# EAGLE schematic display-board (EAGLE 7.7.0)
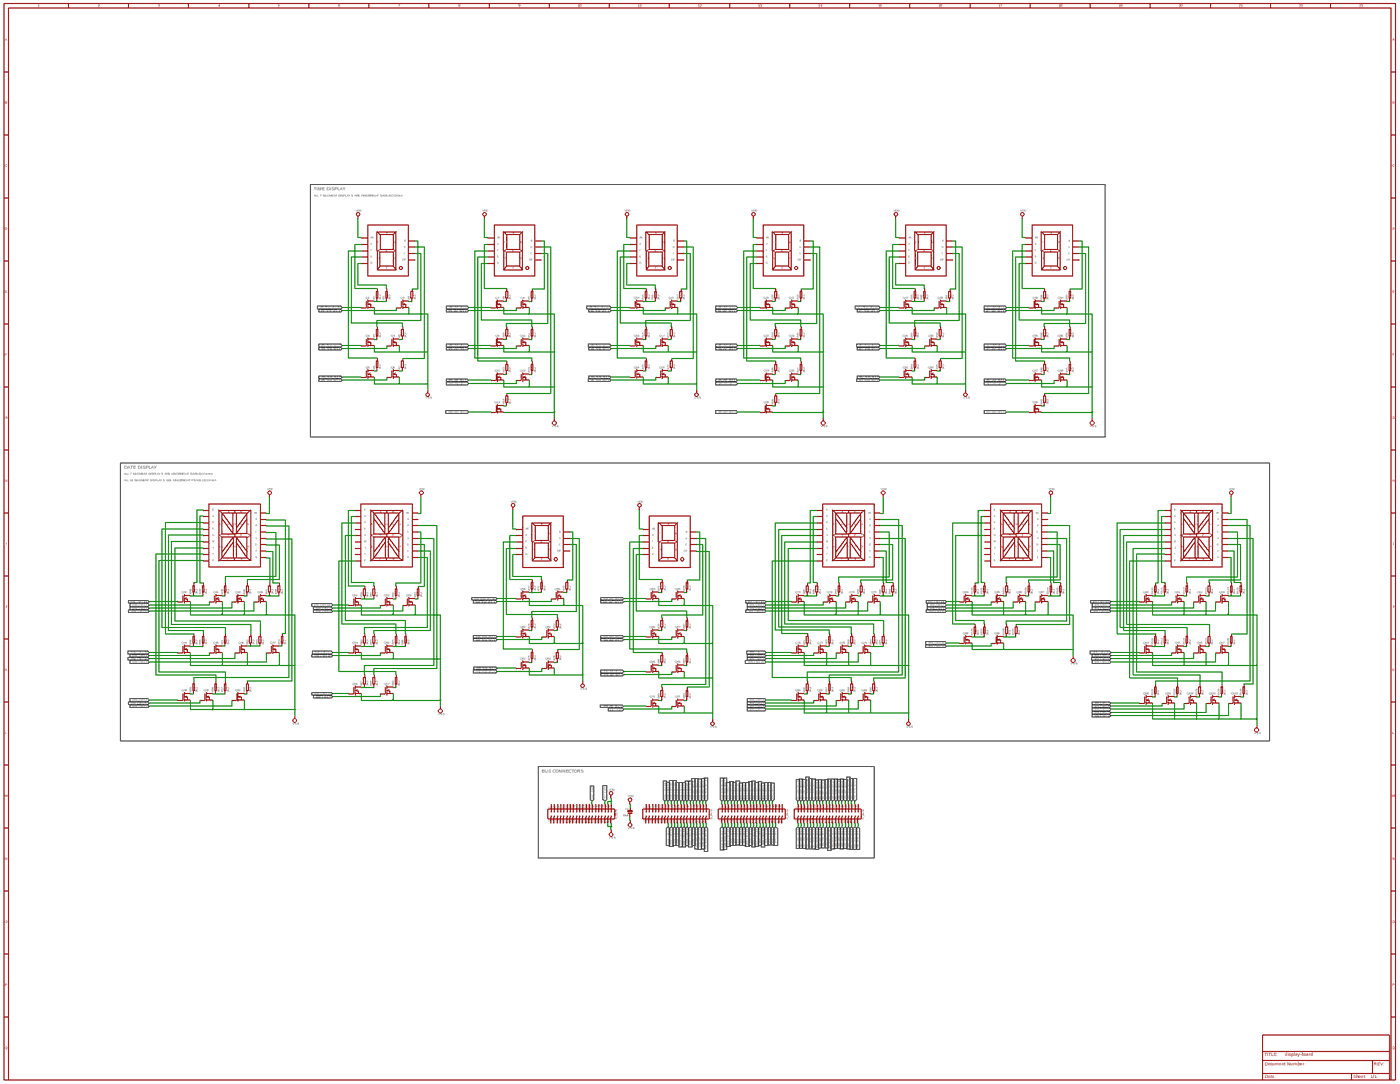
[diagram p0: schematic, sheet 1, overview]
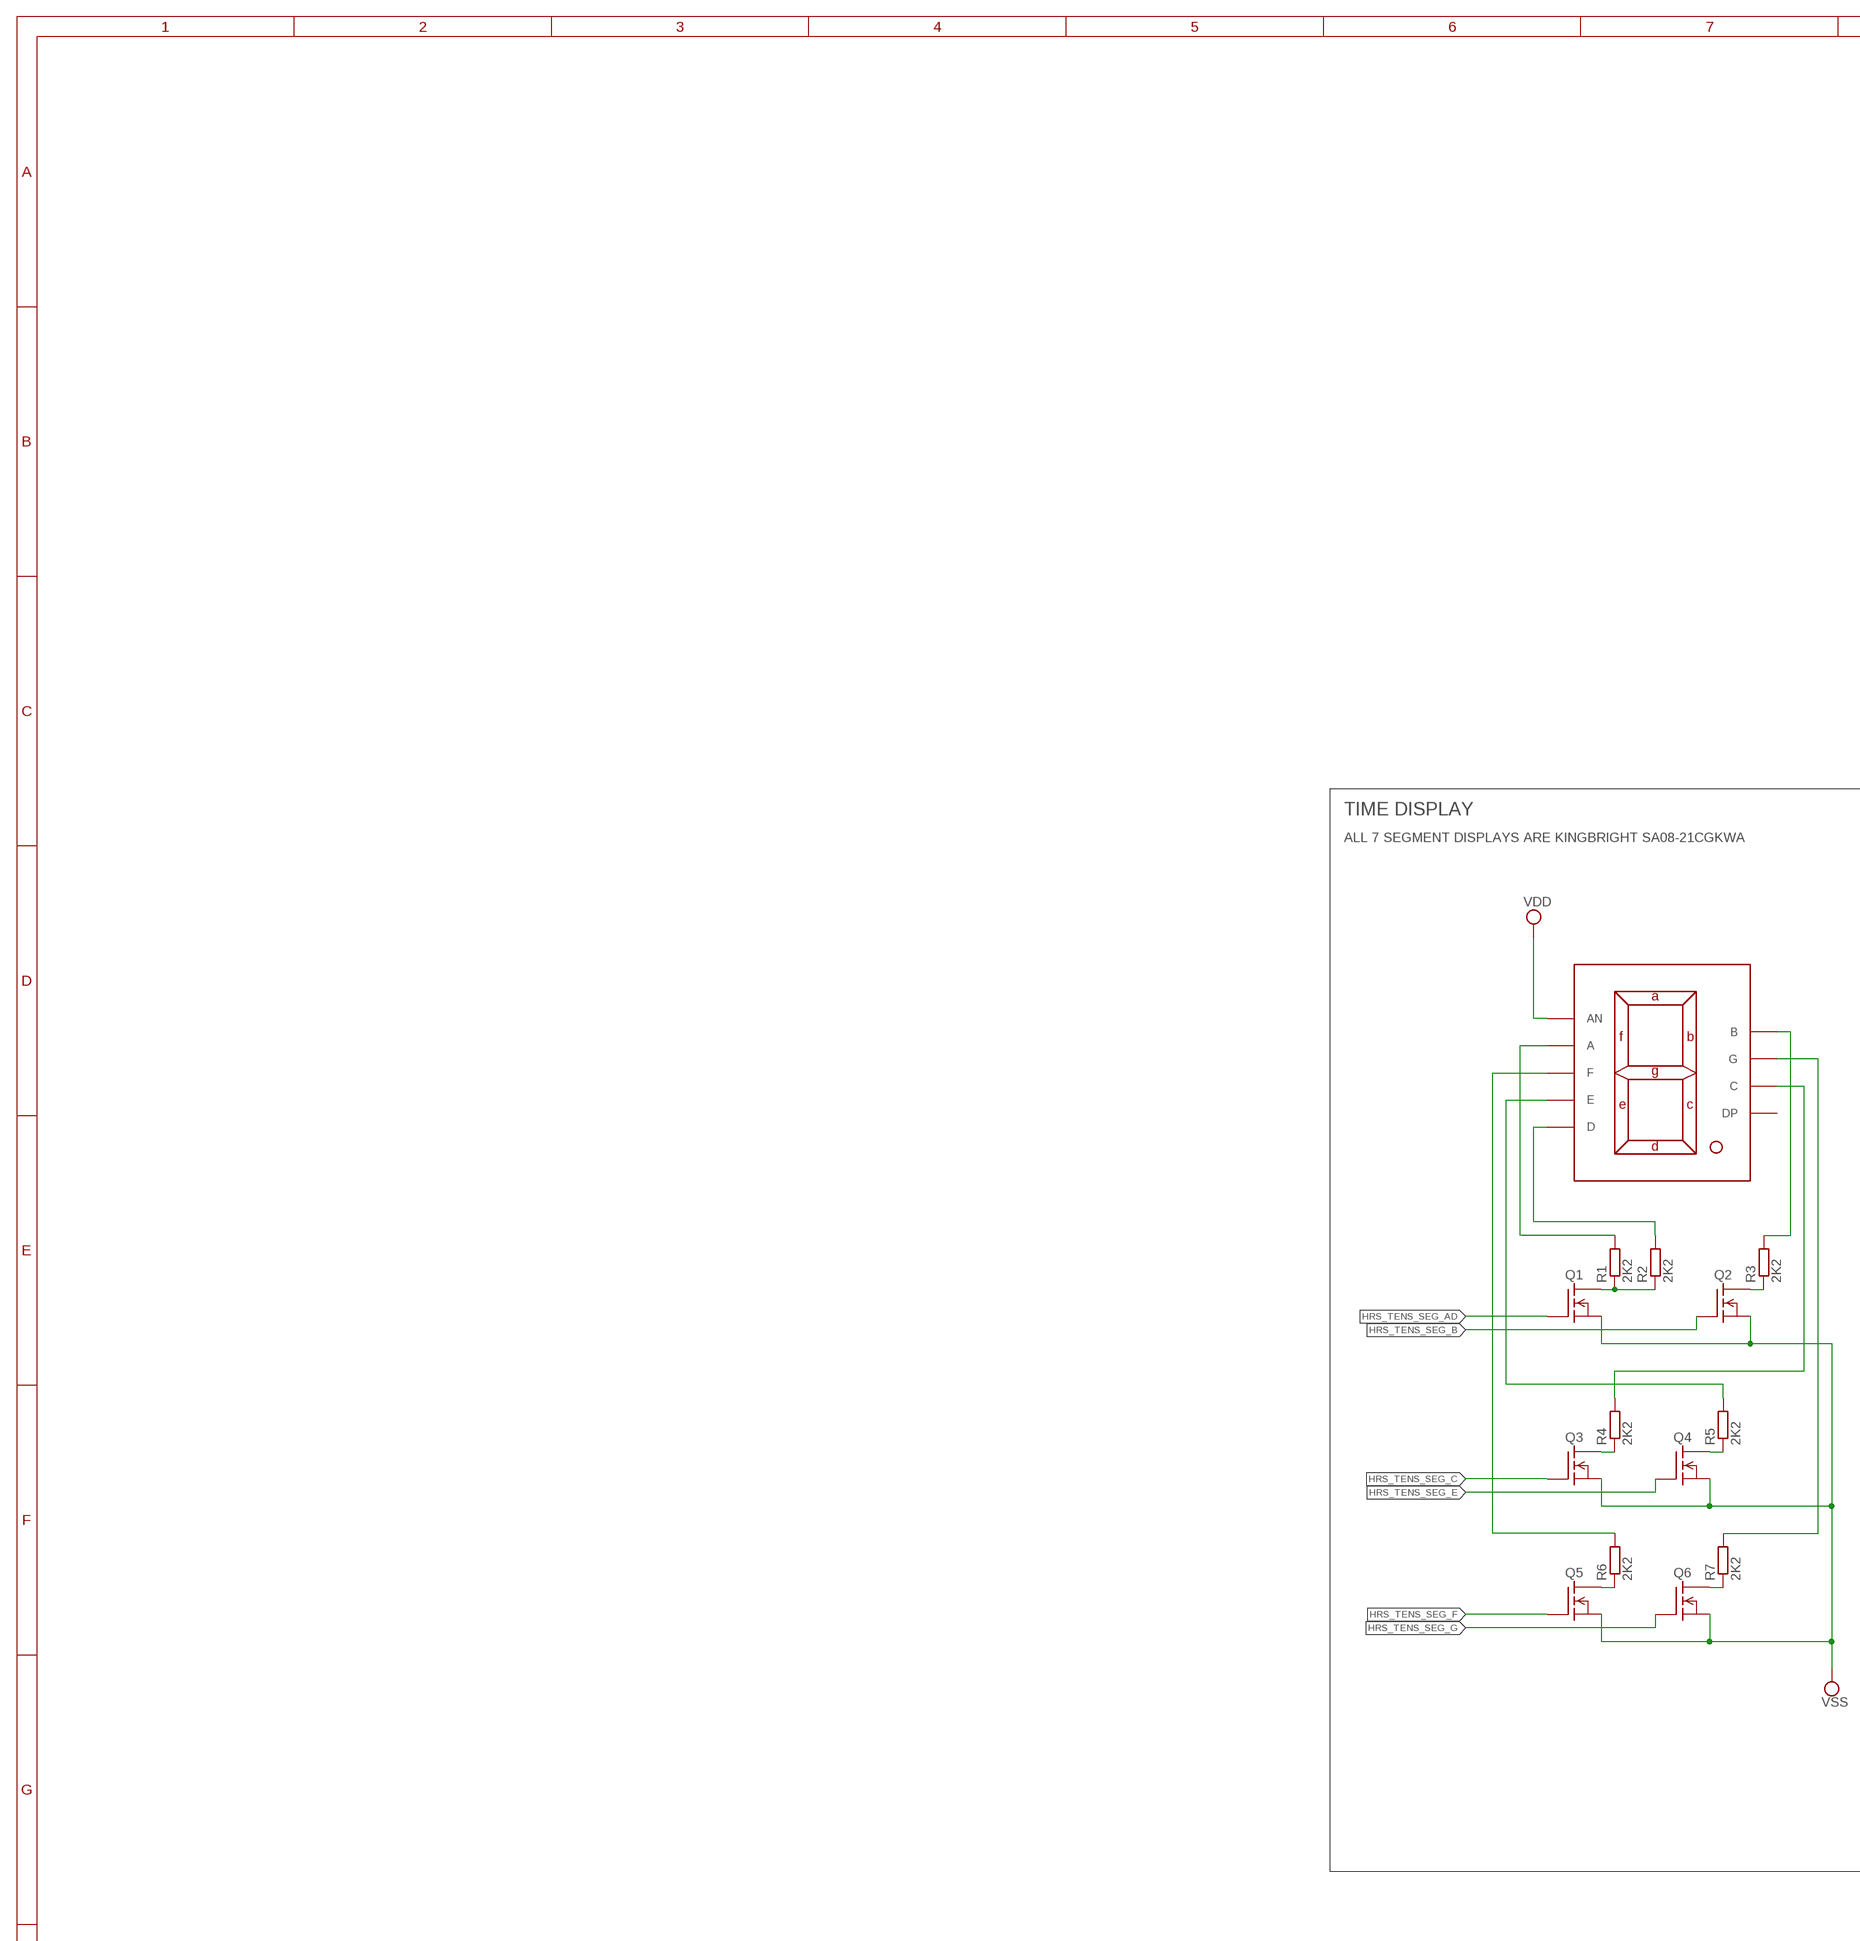
[diagram p1: schematic, sheet 1, part 1 of 6]
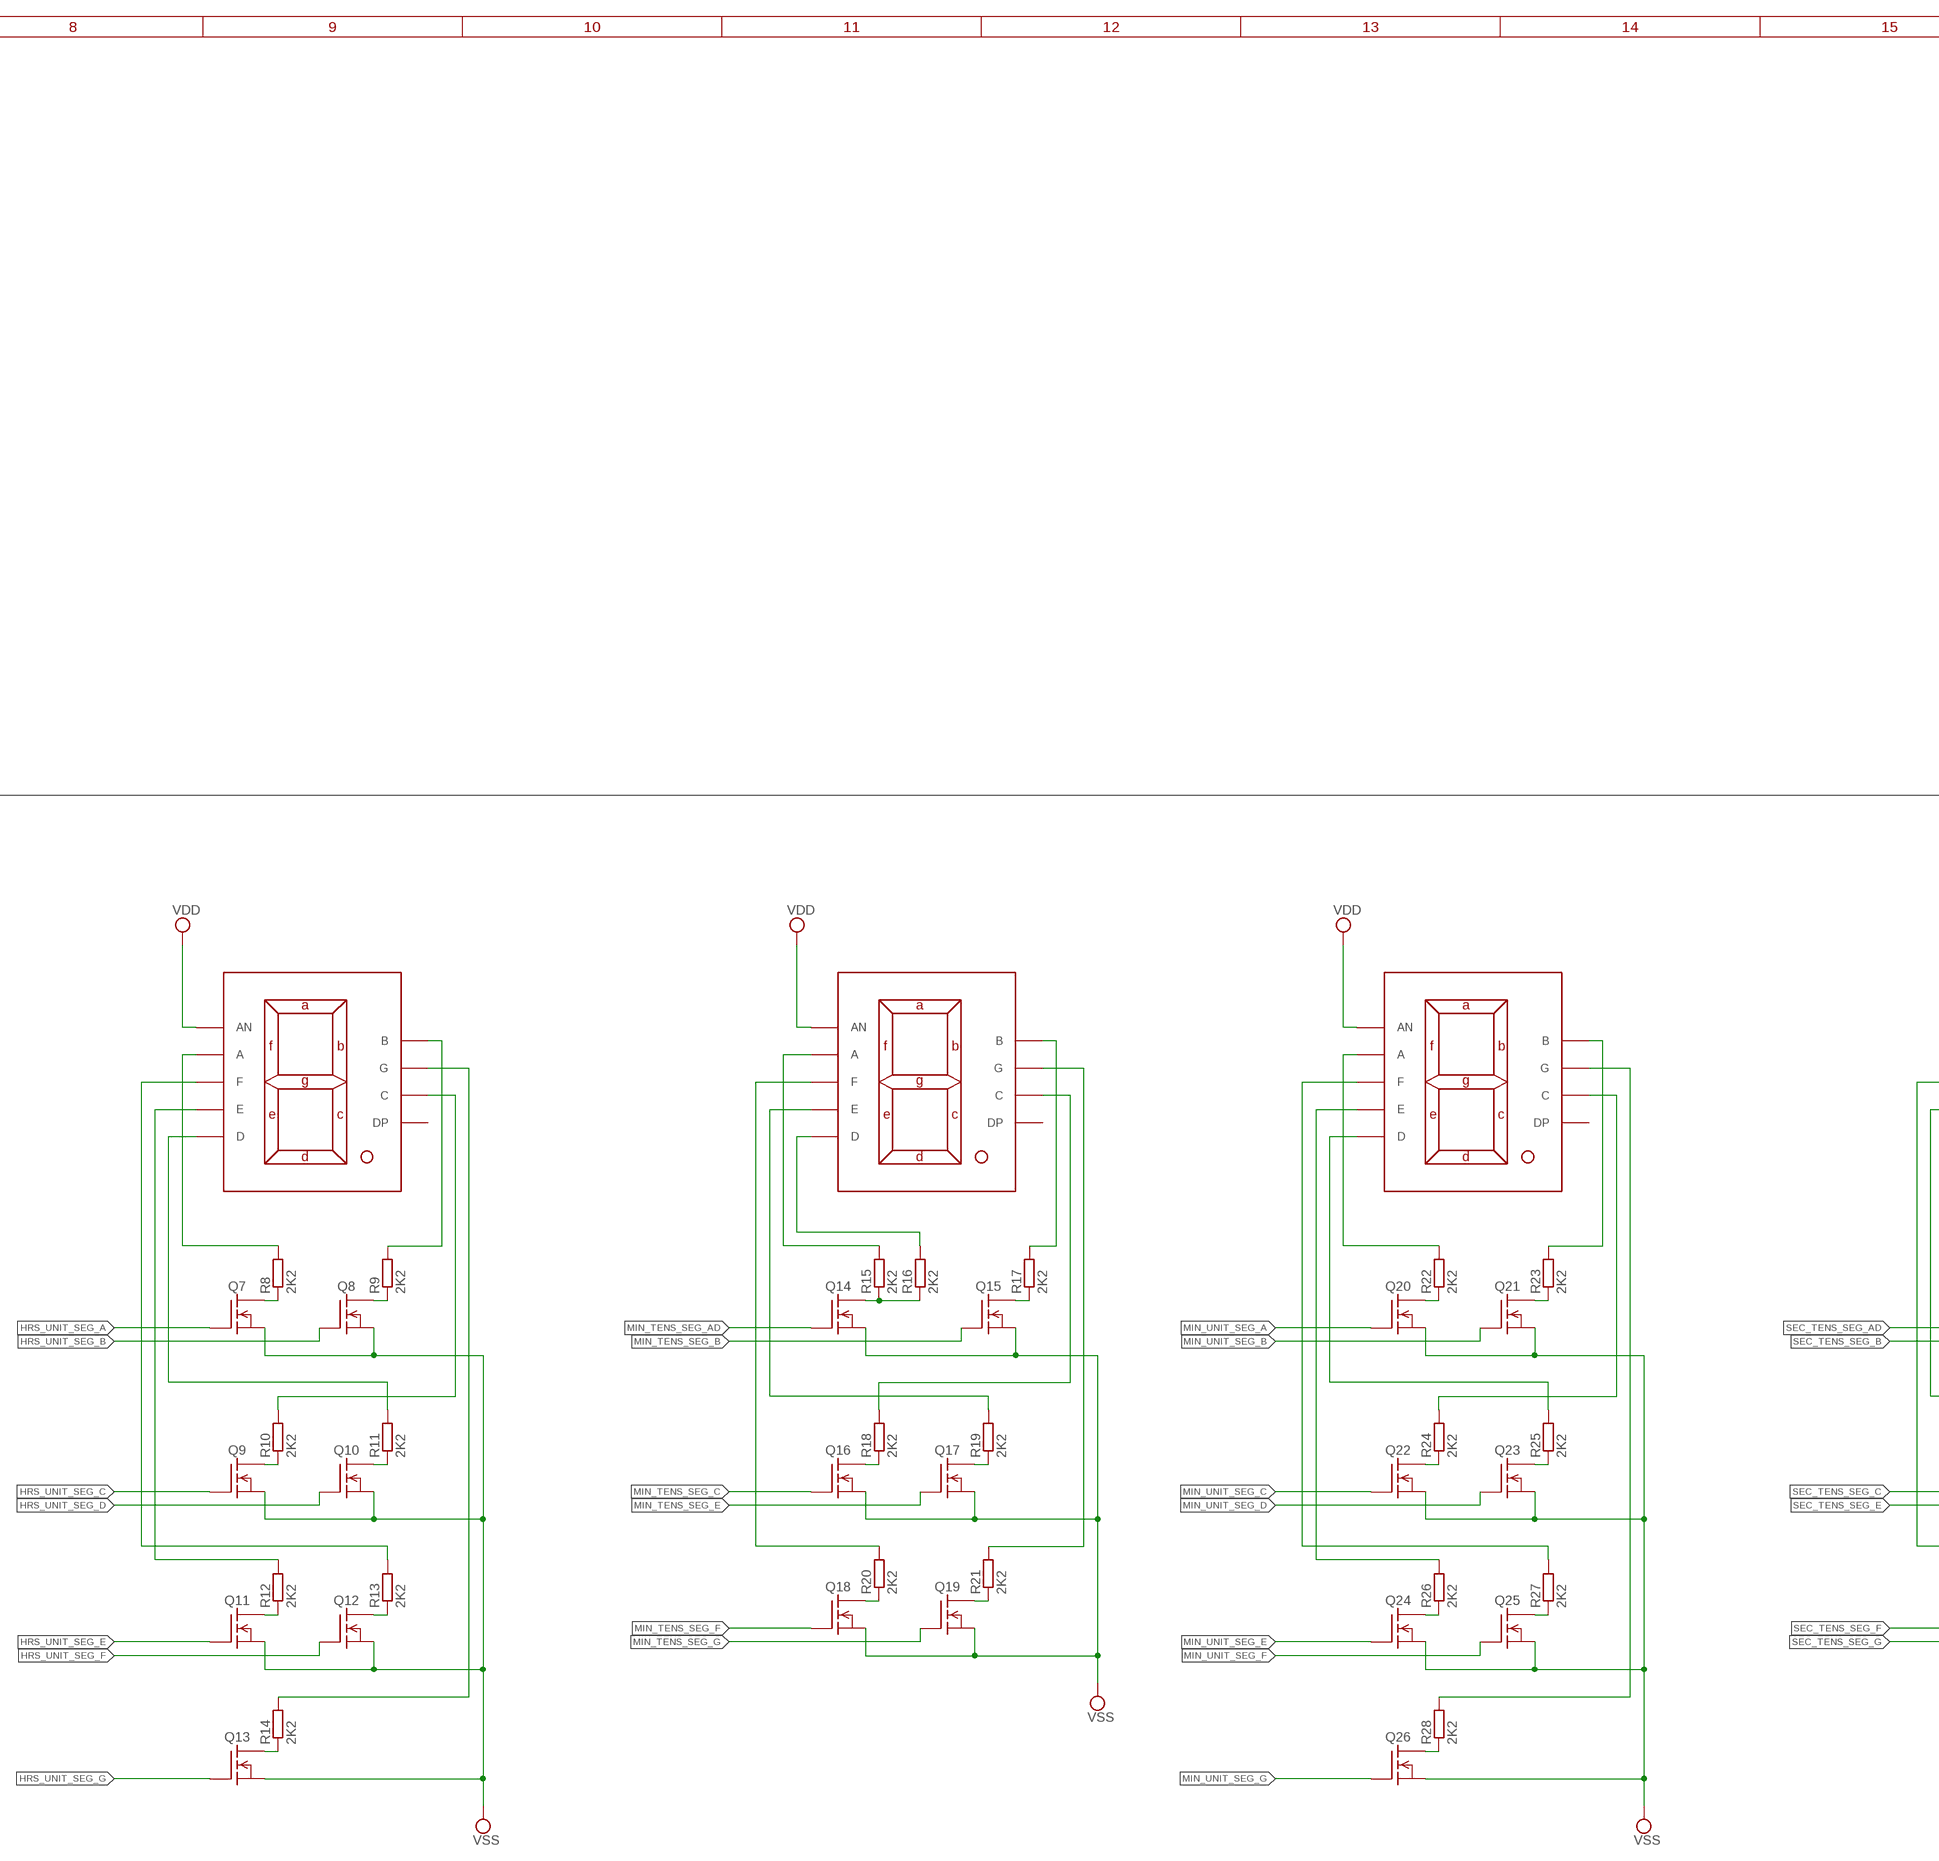
[diagram p2: schematic, sheet 1, part 2 of 6]
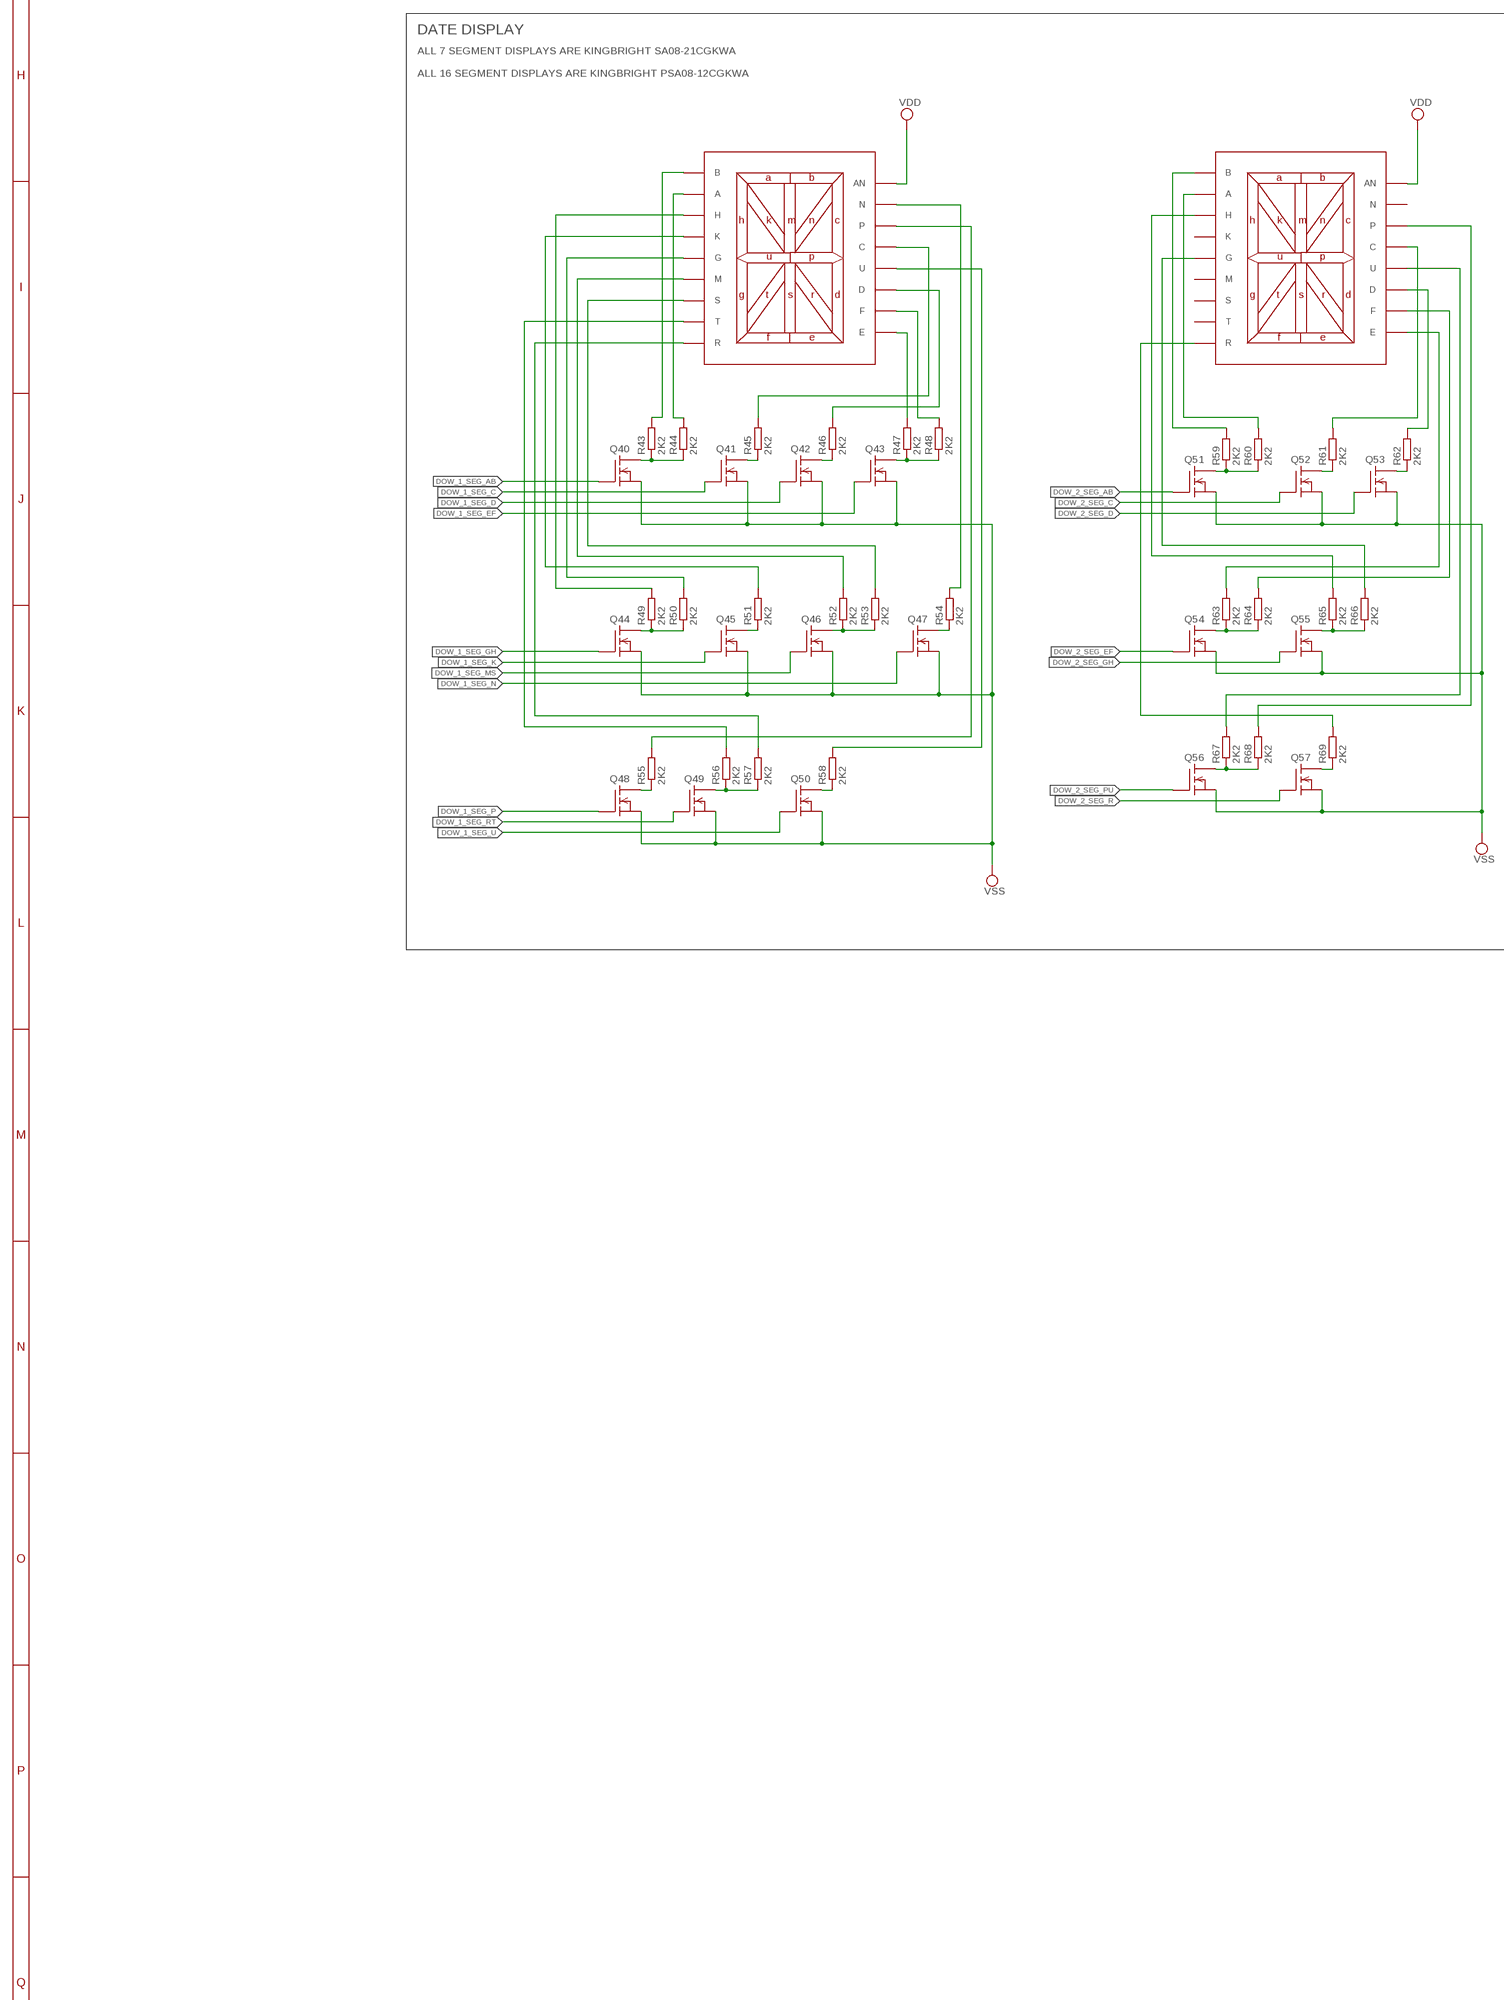
[diagram p3: schematic, sheet 1, part 3 of 6]
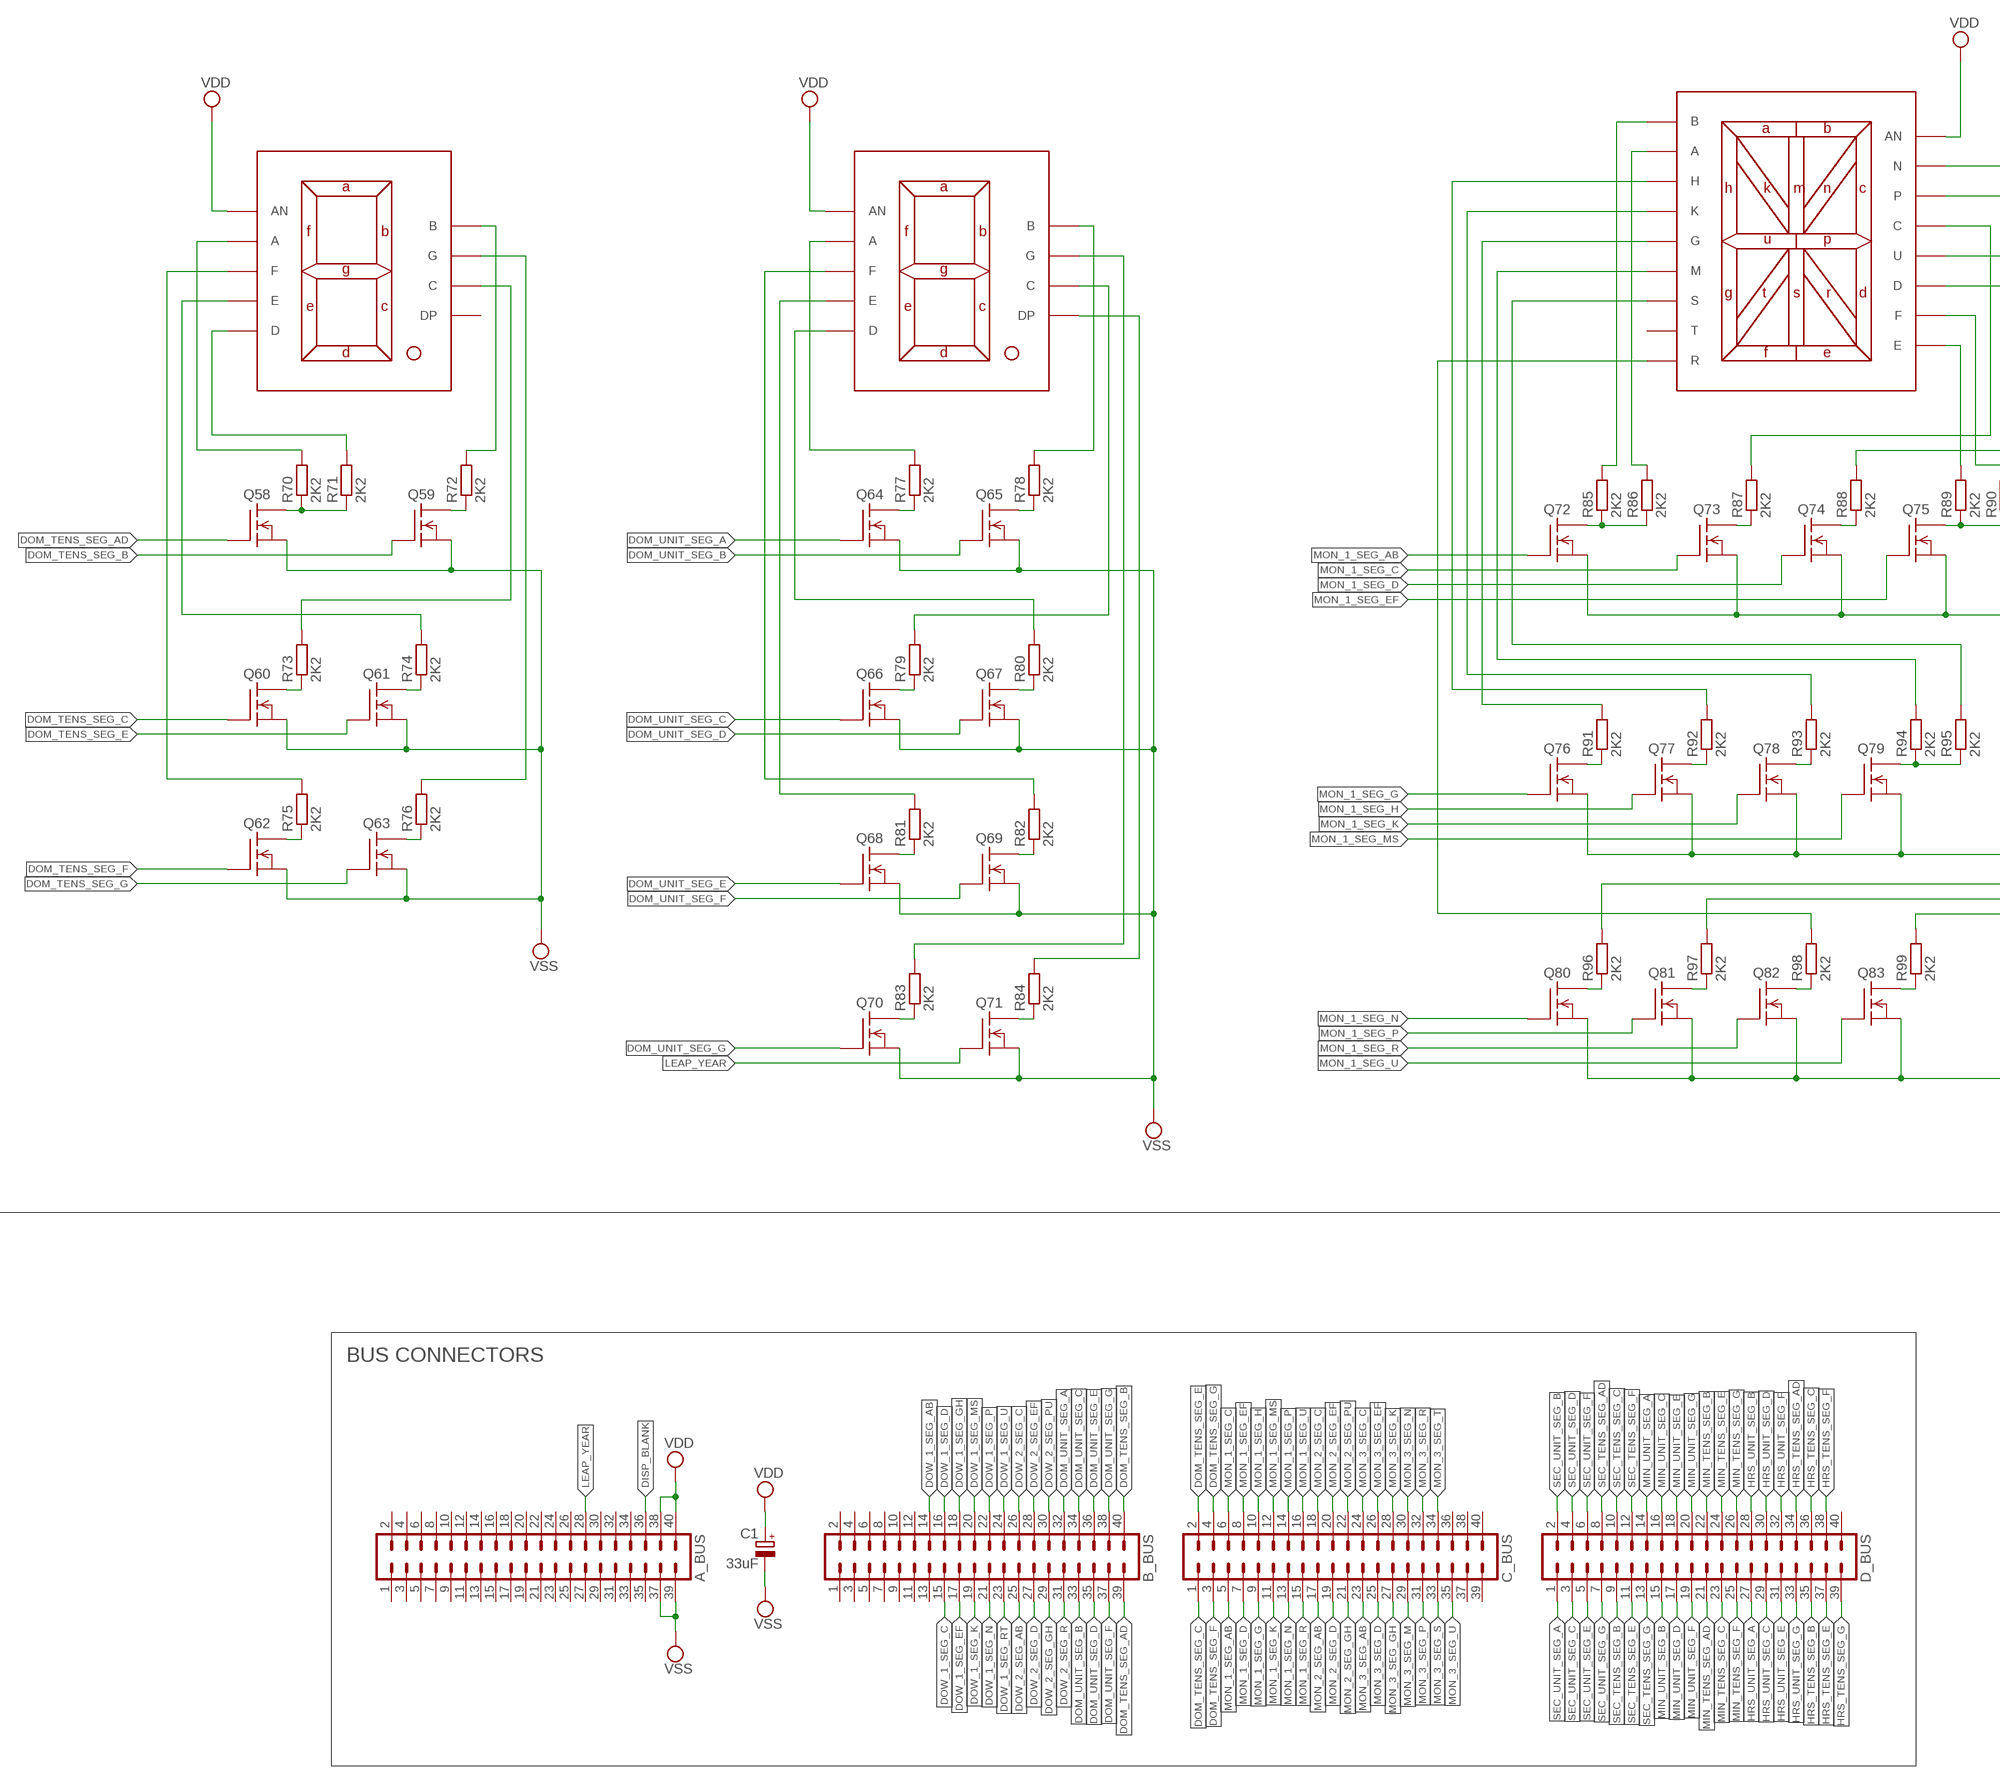
[diagram p4: schematic, sheet 1, part 4 of 6]
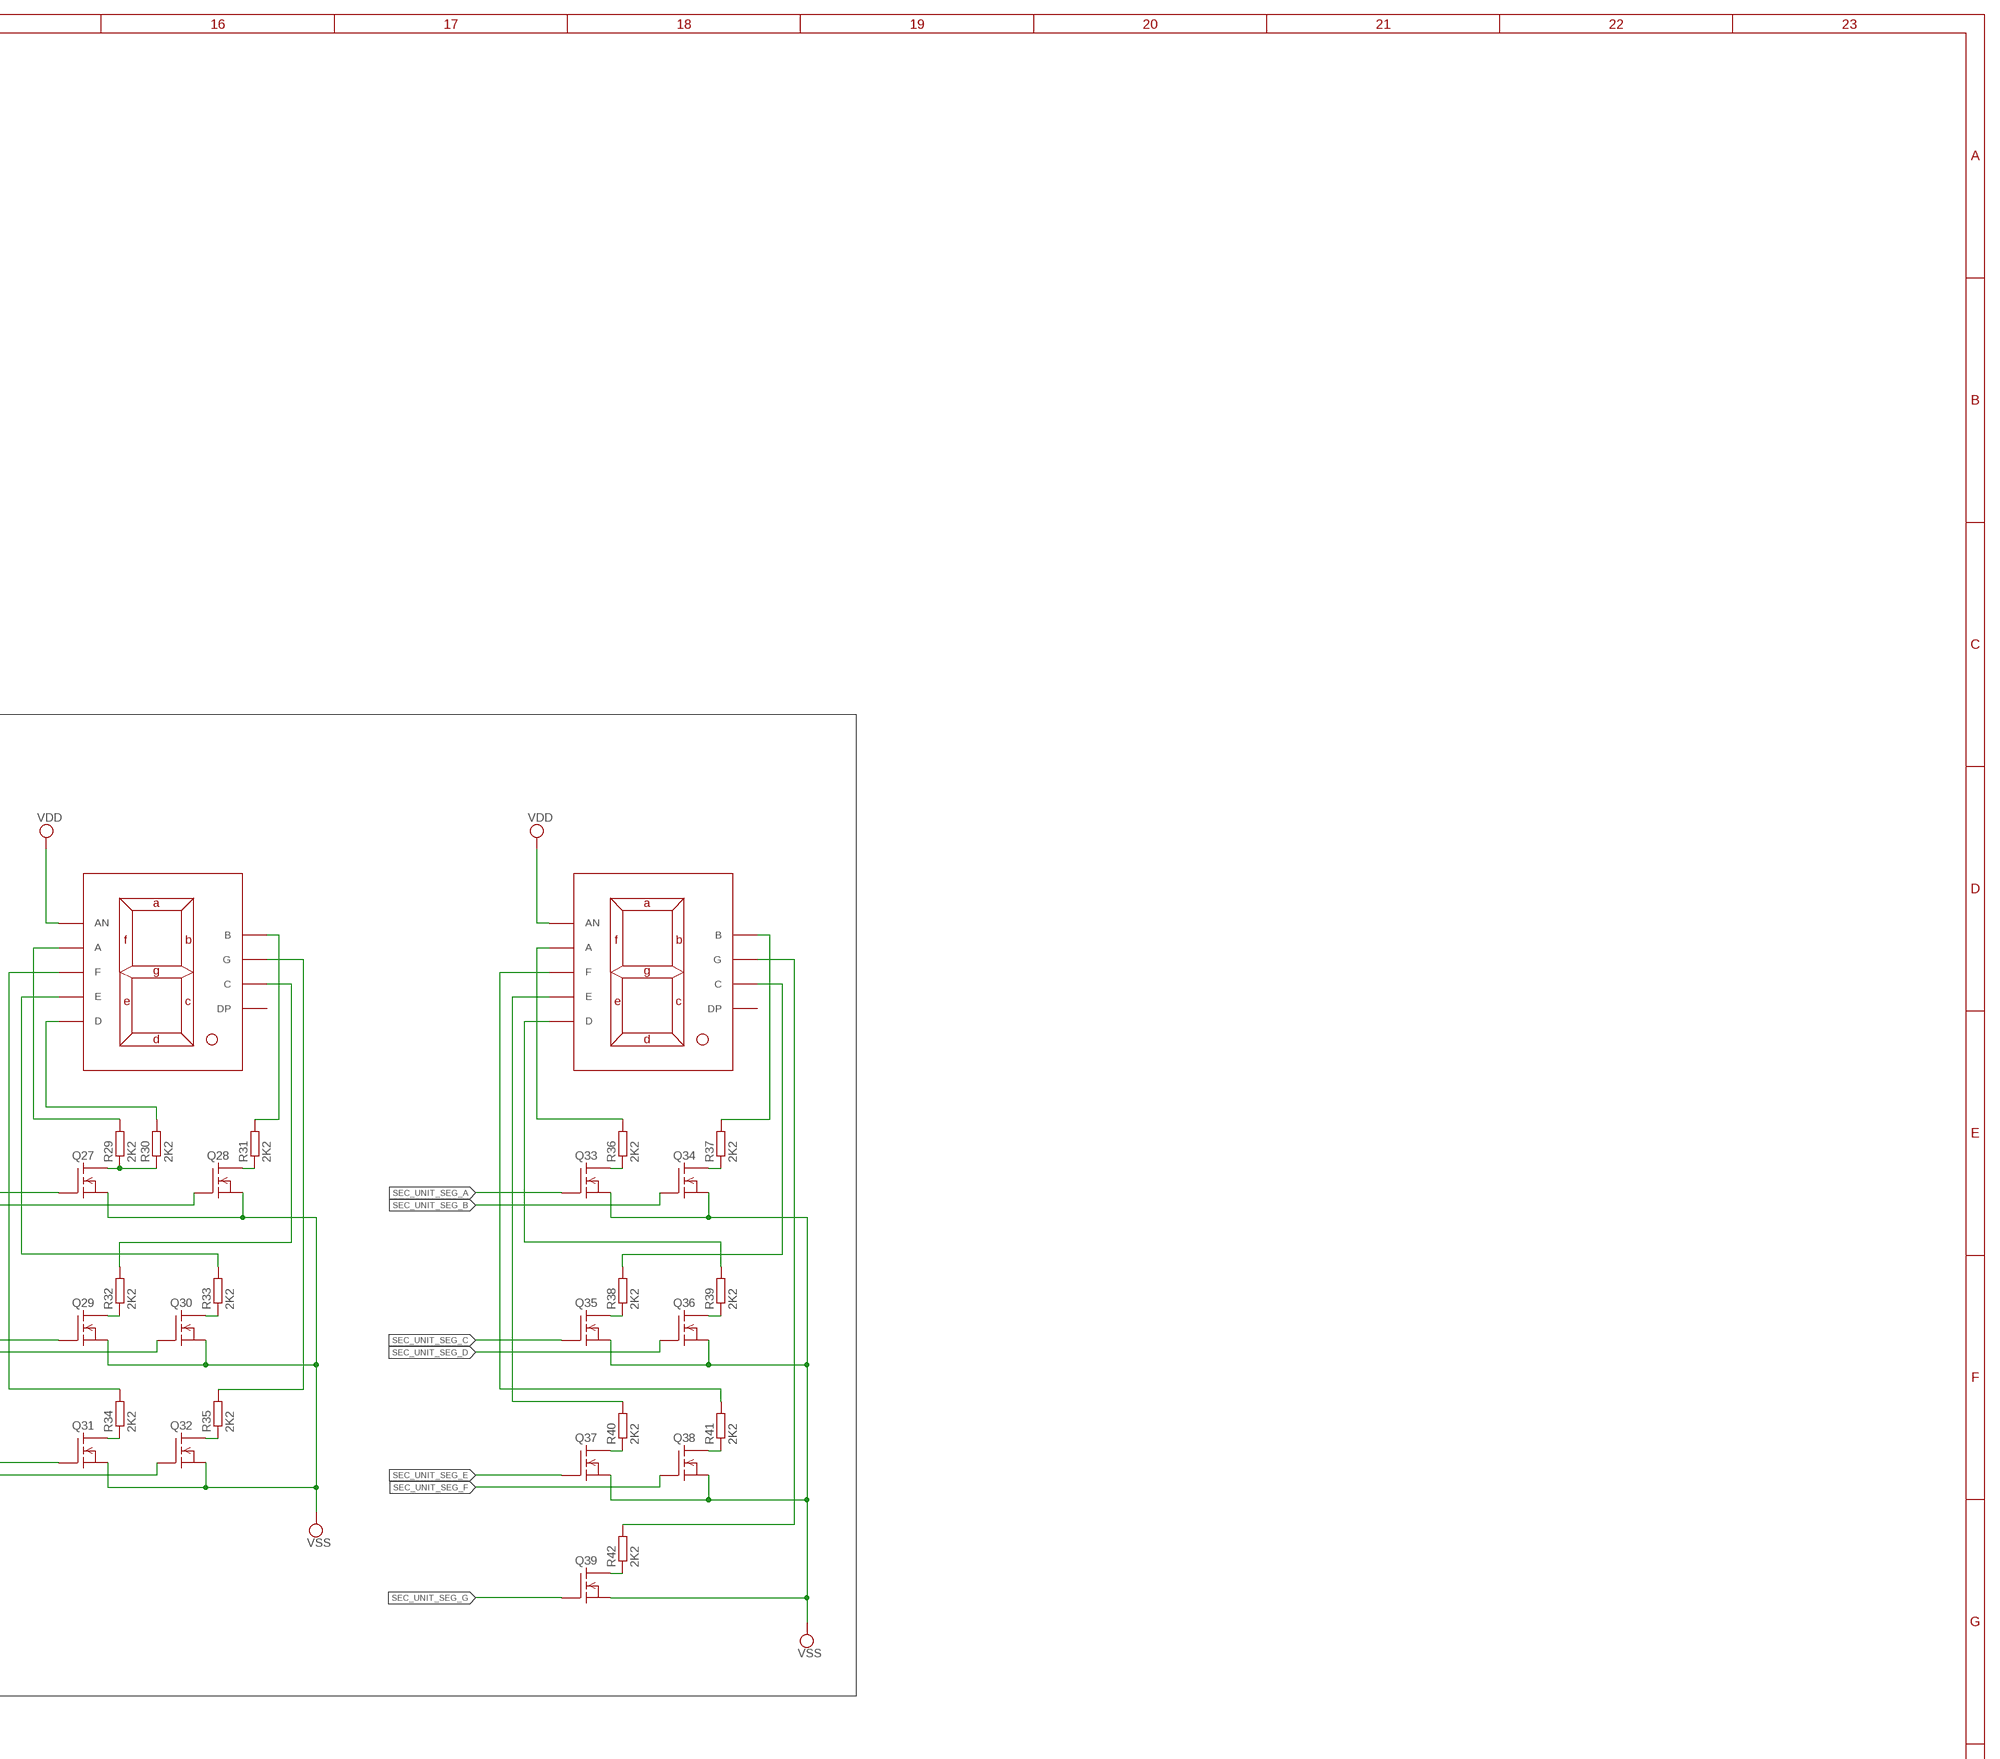
[diagram p5: schematic, sheet 1, part 5 of 6]
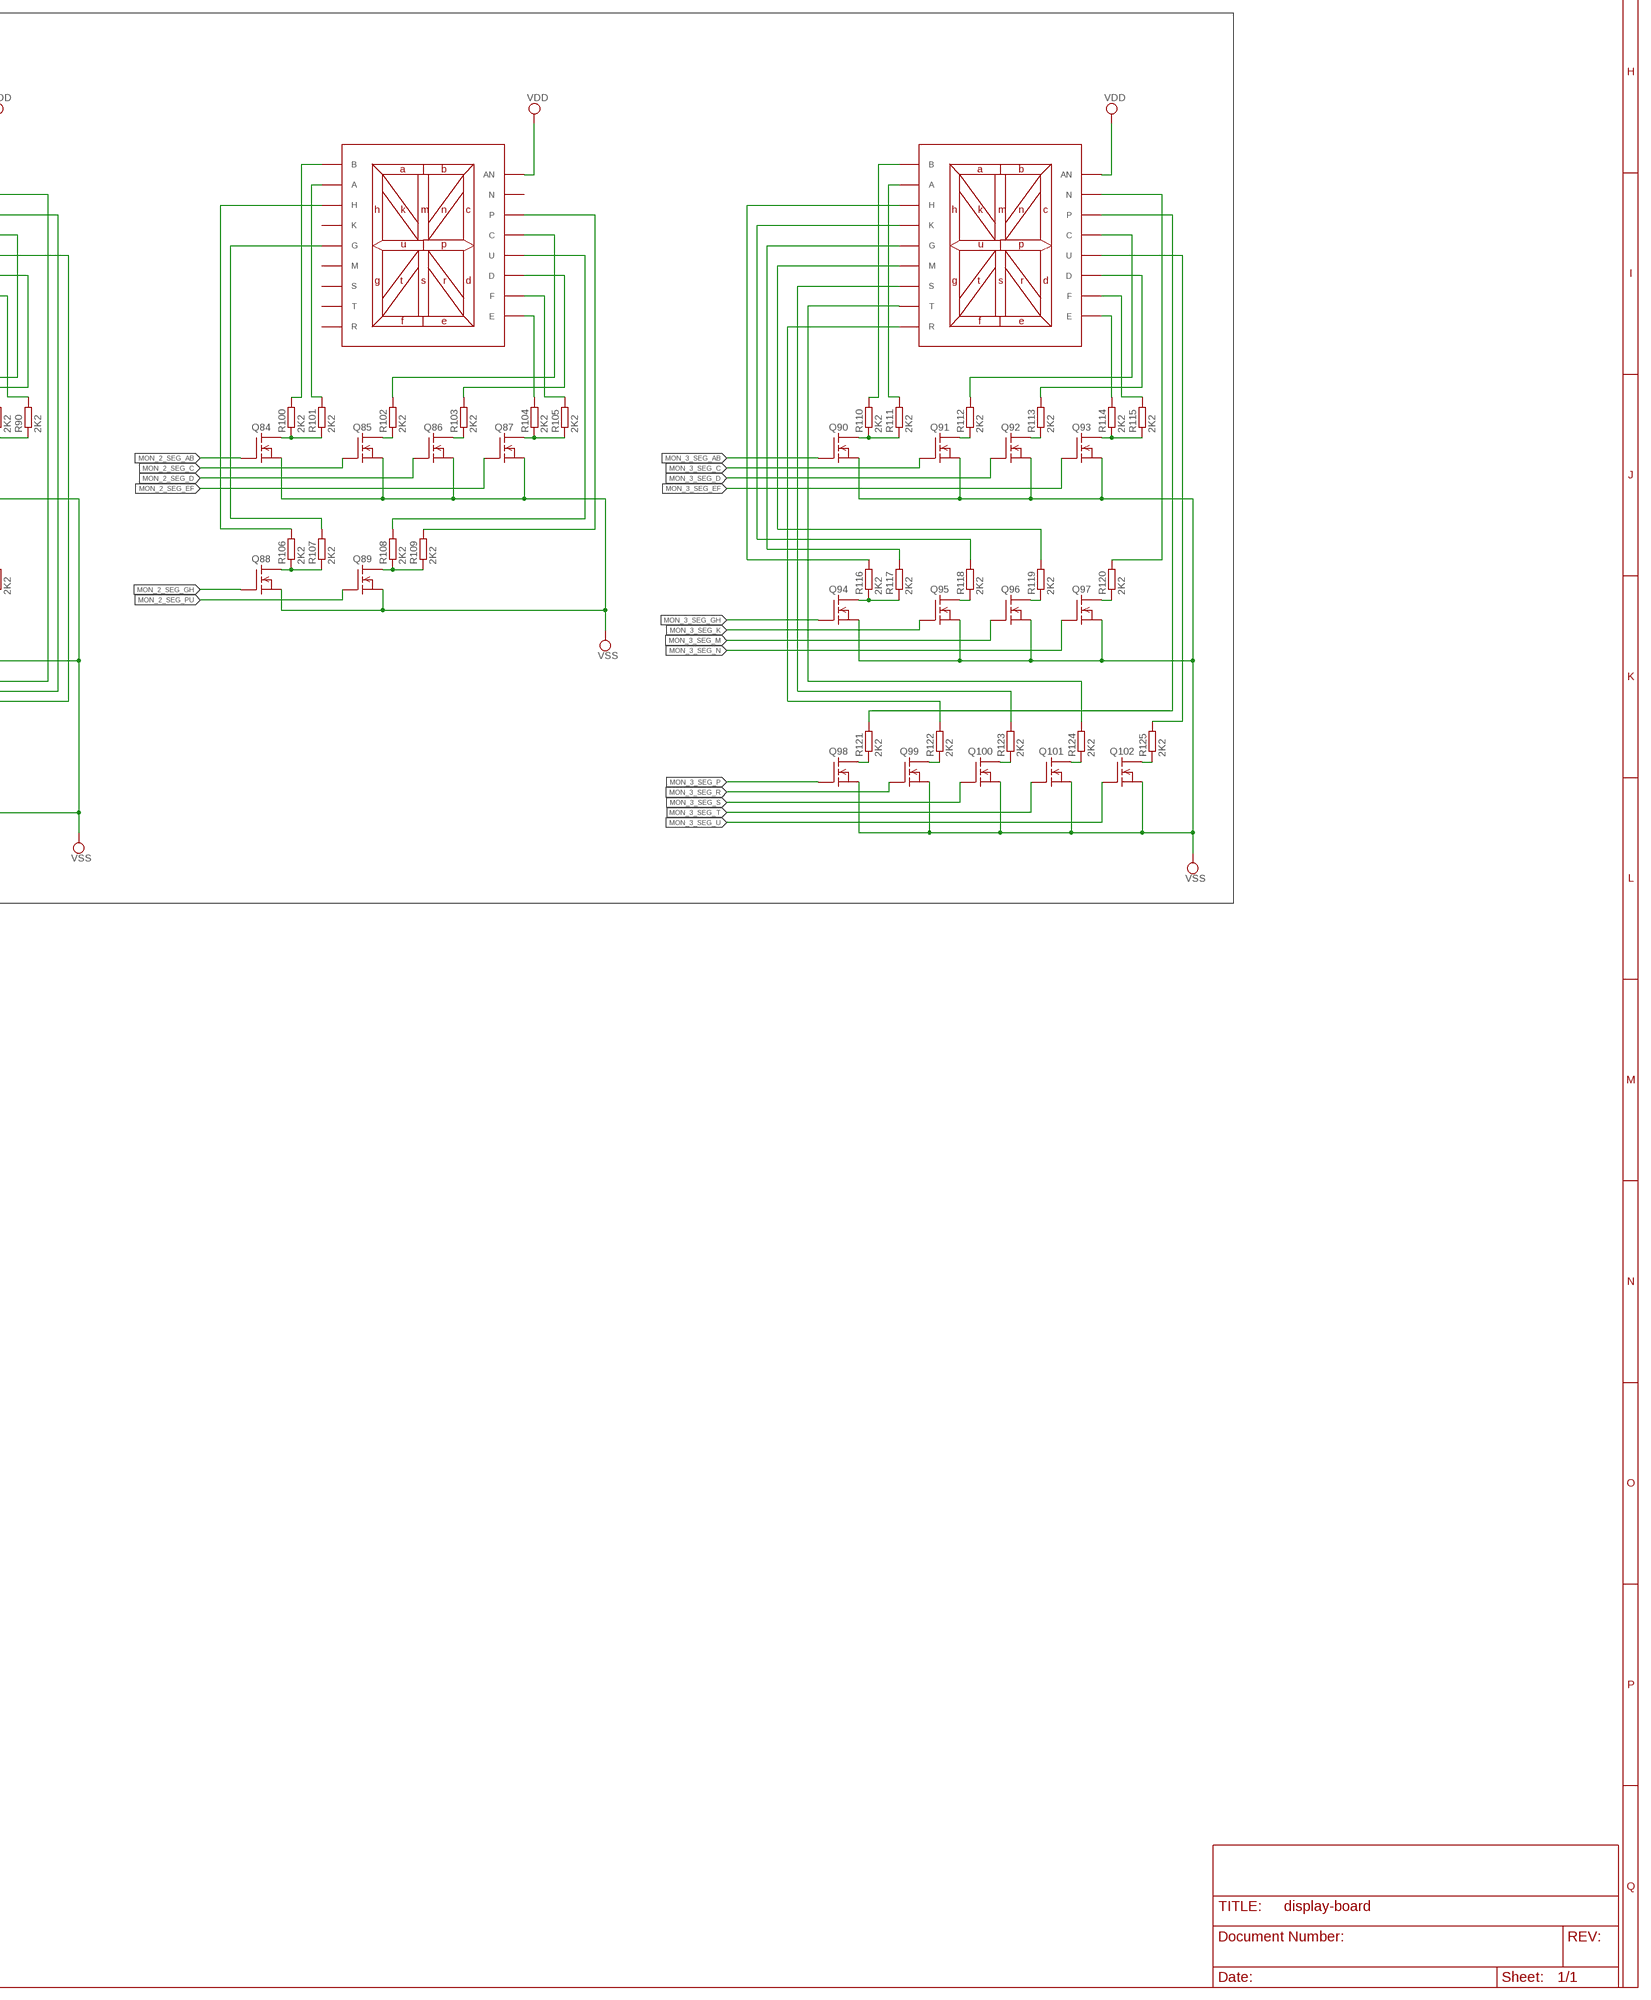
[diagram p6: schematic, sheet 1, part 6 of 6]

## Parts
A_BUS  MA20-2  [MA20-2]
B_BUS  MA20-2  [MA20-2]
C1  33uF  CPOL-EUE2.5-6  [E2,5-6]
C_BUS  MA20-2  [MA20-2]
D_BUS  MA20-2  [MA20-2]
LED1  SA08-21CGKWA  [SA08-21CGKWA]
LED2  SA08-21CGKWA  [SA08-21CGKWA]
LED3  SA08-21CGKWA  [SA08-21CGKWA]
LED4  SA08-21CGKWA  [SA08-21CGKWA]
LED5  SA08-21CGKWA  [SA08-21CGKWA]
LED6  SA08-21CGKWA  [SA08-21CGKWA]
LED7  PSA08-12CGKWA  [PSA08-12CGKWA]
LED8  PSA08-12CGKWA  [PSA08-12CGKWA]
LED9  SA08-21CGKWA  [SA08-21CGKWA]
LED10  SA08-21CGKWA  [SA08-21CGKWA]
LED11  PSA08-12CGKWA  [PSA08-12CGKWA]
LED12  PSA08-12CGKWA  [PSA08-12CGKWA]
LED13  PSA08-12CGKWA  [PSA08-12CGKWA]
Q1  2N7000  [TO-92]
Q2  2N7000  [TO-92]
Q3  2N7000  [TO-92]
Q4  2N7000  [TO-92]
Q5  2N7000  [TO-92]
Q6  2N7000  [TO-92]
Q7  2N7000  [TO-92]
Q8  2N7000  [TO-92]
Q9  2N7000  [TO-92]
Q10  2N7000  [TO-92]
Q11  2N7000  [TO-92]
Q12  2N7000  [TO-92]
Q13  2N7000  [TO-92]
Q14  2N7000  [TO-92]
Q15  2N7000  [TO-92]
Q16  2N7000  [TO-92]
Q17  2N7000  [TO-92]
Q18  2N7000  [TO-92]
Q19  2N7000  [TO-92]
Q20  2N7000  [TO-92]
Q21  2N7000  [TO-92]
Q22  2N7000  [TO-92]
Q23  2N7000  [TO-92]
Q24  2N7000  [TO-92]
Q25  2N7000  [TO-92]
Q26  2N7000  [TO-92]
Q27  2N7000  [TO-92]
Q28  2N7000  [TO-92]
Q29  2N7000  [TO-92]
Q30  2N7000  [TO-92]
Q31  2N7000  [TO-92]
Q32  2N7000  [TO-92]
Q33  2N7000  [TO-92]
Q34  2N7000  [TO-92]
Q35  2N7000  [TO-92]
Q36  2N7000  [TO-92]
Q37  2N7000  [TO-92]
Q38  2N7000  [TO-92]
Q39  2N7000  [TO-92]
Q40  2N7000  [TO-92]
Q41  2N7000  [TO-92]
Q42  2N7000  [TO-92]
Q43  2N7000  [TO-92]
Q44  2N7000  [TO-92]
Q45  2N7000  [TO-92]
Q46  2N7000  [TO-92]
Q47  2N7000  [TO-92]
Q48  2N7000  [TO-92]
Q49  2N7000  [TO-92]
Q50  2N7000  [TO-92]
Q51  2N7000  [TO-92]
Q52  2N7000  [TO-92]
Q53  2N7000  [TO-92]
Q54  2N7000  [TO-92]
Q55  2N7000  [TO-92]
Q56  2N7000  [TO-92]
Q57  2N7000  [TO-92]
Q58  2N7000  [TO-92]
Q59  2N7000  [TO-92]
Q60  2N7000  [TO-92]
Q61  2N7000  [TO-92]
Q62  2N7000  [TO-92]
Q63  2N7000  [TO-92]
Q64  2N7000  [TO-92]
Q65  2N7000  [TO-92]
Q66  2N7000  [TO-92]
Q67  2N7000  [TO-92]
Q68  2N7000  [TO-92]
Q69  2N7000  [TO-92]
Q70  2N7000  [TO-92]
Q71  2N7000  [TO-92]
Q72  2N7000  [TO-92]
Q73  2N7000  [TO-92]
Q74  2N7000  [TO-92]
Q75  2N7000  [TO-92]
Q76  2N7000  [TO-92]
Q77  2N7000  [TO-92]
Q78  2N7000  [TO-92]
Q79  2N7000  [TO-92]
Q80  2N7000  [TO-92]
Q81  2N7000  [TO-92]
Q82  2N7000  [TO-92]
Q83  2N7000  [TO-92]
Q84  2N7000  [TO-92]
Q85  2N7000  [TO-92]
Q86  2N7000  [TO-92]
Q87  2N7000  [TO-92]
Q88  2N7000  [TO-92]
Q89  2N7000  [TO-92]
Q90  2N7000  [TO-92]
Q91  2N7000  [TO-92]
Q92  2N7000  [TO-92]
Q93  2N7000  [TO-92]
Q94  2N7000  [TO-92]
Q95  2N7000  [TO-92]
Q96  2N7000  [TO-92]
Q97  2N7000  [TO-92]
Q98  2N7000  [TO-92]
Q99  2N7000  [TO-92]
Q100  2N7000  [TO-92]
Q101  2N7000  [TO-92]
Q102  2N7000  [TO-92]
R1  2K2  R-EU_0207/2V  [0207/2V]
R2  2K2  R-EU_0207/2V  [0207/2V]
R3  2K2  R-EU_0207/2V  [0207/2V]
R4  2K2  R-EU_0207/2V  [0207/2V]
R5  2K2  R-EU_0207/2V  [0207/2V]
R6  2K2  R-EU_0207/2V  [0207/2V]
R7  2K2  R-EU_0207/2V  [0207/2V]
R8  2K2  R-EU_0207/2V  [0207/2V]
R9  2K2  R-EU_0207/2V  [0207/2V]
R10  2K2  R-EU_0207/2V  [0207/2V]
R11  2K2  R-EU_0207/2V  [0207/2V]
R12  2K2  R-EU_0207/2V  [0207/2V]
R13  2K2  R-EU_0207/2V  [0207/2V]
R14  2K2  R-EU_0207/2V  [0207/2V]
R15  2K2  R-EU_0207/2V  [0207/2V]
R16  2K2  R-EU_0207/2V  [0207/2V]
R17  2K2  R-EU_0207/2V  [0207/2V]
R18  2K2  R-EU_0207/2V  [0207/2V]
R19  2K2  R-EU_0207/2V  [0207/2V]
R20  2K2  R-EU_0207/2V  [0207/2V]
R21  2K2  R-EU_0207/2V  [0207/2V]
R22  2K2  R-EU_0207/2V  [0207/2V]
R23  2K2  R-EU_0207/2V  [0207/2V]
R24  2K2  R-EU_0207/2V  [0207/2V]
R25  2K2  R-EU_0207/2V  [0207/2V]
R26  2K2  R-EU_0207/2V  [0207/2V]
R27  2K2  R-EU_0207/2V  [0207/2V]
R28  2K2  R-EU_0207/2V  [0207/2V]
R29  2K2  R-EU_0207/2V  [0207/2V]
R30  2K2  R-EU_0207/2V  [0207/2V]
R31  2K2  R-EU_0207/2V  [0207/2V]
R32  2K2  R-EU_0207/2V  [0207/2V]
R33  2K2  R-EU_0207/2V  [0207/2V]
R34  2K2  R-EU_0207/2V  [0207/2V]
R35  2K2  R-EU_0207/2V  [0207/2V]
R36  2K2  R-EU_0207/2V  [0207/2V]
R37  2K2  R-EU_0207/2V  [0207/2V]
R38  2K2  R-EU_0207/2V  [0207/2V]
R39  2K2  R-EU_0207/2V  [0207/2V]
R40  2K2  R-EU_0207/2V  [0207/2V]
R41  2K2  R-EU_0207/2V  [0207/2V]
R42  2K2  R-EU_0207/2V  [0207/2V]
R43  2K2  R-EU_0207/2V  [0207/2V]
R44  2K2  R-EU_0207/2V  [0207/2V]
R45  2K2  R-EU_0207/2V  [0207/2V]
R46  2K2  R-EU_0207/2V  [0207/2V]
R47  2K2  R-EU_0207/2V  [0207/2V]
R48  2K2  R-EU_0207/2V  [0207/2V]
R49  2K2  R-EU_0207/2V  [0207/2V]
R50  2K2  R-EU_0207/2V  [0207/2V]
R51  2K2  R-EU_0207/2V  [0207/2V]
R52  2K2  R-EU_0207/2V  [0207/2V]
R53  2K2  R-EU_0207/2V  [0207/2V]
R54  2K2  R-EU_0207/2V  [0207/2V]
R55  2K2  R-EU_0207/2V  [0207/2V]
R56  2K2  R-EU_0207/2V  [0207/2V]
R57  2K2  R-EU_0207/2V  [0207/2V]
R58  2K2  R-EU_0207/2V  [0207/2V]
R59  2K2  R-EU_0207/2V  [0207/2V]
R60  2K2  R-EU_0207/2V  [0207/2V]
R61  2K2  R-EU_0207/2V  [0207/2V]
R62  2K2  R-EU_0207/2V  [0207/2V]
R63  2K2  R-EU_0207/2V  [0207/2V]
R64  2K2  R-EU_0207/2V  [0207/2V]
R65  2K2  R-EU_0207/2V  [0207/2V]
R66  2K2  R-EU_0207/2V  [0207/2V]
R67  2K2  R-EU_0207/2V  [0207/2V]
R68  2K2  R-EU_0207/2V  [0207/2V]
R69  2K2  R-EU_0207/2V  [0207/2V]
R70  2K2  R-EU_0207/2V  [0207/2V]
R71  2K2  R-EU_0207/2V  [0207/2V]
R72  2K2  R-EU_0207/2V  [0207/2V]
R73  2K2  R-EU_0207/2V  [0207/2V]
R74  2K2  R-EU_0207/2V  [0207/2V]
R75  2K2  R-EU_0207/2V  [0207/2V]
R76  2K2  R-EU_0207/2V  [0207/2V]
R77  2K2  R-EU_0207/2V  [0207/2V]
R78  2K2  R-EU_0207/2V  [0207/2V]
R79  2K2  R-EU_0207/2V  [0207/2V]
R80  2K2  R-EU_0207/2V  [0207/2V]
R81  2K2  R-EU_0207/2V  [0207/2V]
R82  2K2  R-EU_0207/2V  [0207/2V]
R83  2K2  R-EU_0207/2V  [0207/2V]
R84  2K2  R-EU_0207/2V  [0207/2V]
R85  2K2  R-EU_0207/2V  [0207/2V]
R86  2K2  R-EU_0207/2V  [0207/2V]
R87  2K2  R-EU_0207/2V  [0207/2V]
R88  2K2  R-EU_0207/2V  [0207/2V]
R89  2K2  R-EU_0207/2V  [0207/2V]
R90  2K2  R-EU_0207/2V  [0207/2V]
R91  2K2  R-EU_0207/2V  [0207/2V]
R92  2K2  R-EU_0207/2V  [0207/2V]
R93  2K2  R-EU_0207/2V  [0207/2V]
R94  2K2  R-EU_0207/2V  [0207/2V]
R95  2K2  R-EU_0207/2V  [0207/2V]
R96  2K2  R-EU_0207/2V  [0207/2V]
R97  2K2  R-EU_0207/2V  [0207/2V]
R98  2K2  R-EU_0207/2V  [0207/2V]
R99  2K2  R-EU_0207/2V  [0207/2V]
R100  2K2  R-EU_0207/2V  [0207/2V]
R101  2K2  R-EU_0207/2V  [0207/2V]
R102  2K2  R-EU_0207/2V  [0207/2V]
R103  2K2  R-EU_0207/2V  [0207/2V]
R104  2K2  R-EU_0207/2V  [0207/2V]
R105  2K2  R-EU_0207/2V  [0207/2V]
R106  2K2  R-EU_0207/2V  [0207/2V]
R107  2K2  R-EU_0207/2V  [0207/2V]
R108  2K2  R-EU_0207/2V  [0207/2V]
R109  2K2  R-EU_0207/2V  [0207/2V]
R110  2K2  R-EU_0207/2V  [0207/2V]
R111  2K2  R-EU_0207/2V  [0207/2V]
R112  2K2  R-EU_0207/2V  [0207/2V]
R113  2K2  R-EU_0207/2V  [0207/2V]
R114  2K2  R-EU_0207/2V  [0207/2V]
R115  2K2  R-EU_0207/2V  [0207/2V]
R116  2K2  R-EU_0207/2V  [0207/2V]
R117  2K2  R-EU_0207/2V  [0207/2V]
R118  2K2  R-EU_0207/2V  [0207/2V]
R119  2K2  R-EU_0207/2V  [0207/2V]
R120  2K2  R-EU_0207/2V  [0207/2V]
R121  2K2  R-EU_0207/2V  [0207/2V]
R122  2K2  R-EU_0207/2V  [0207/2V]
R123  2K2  R-EU_0207/2V  [0207/2V]
R124  2K2  R-EU_0207/2V  [0207/2V]
R125  2K2  R-EU_0207/2V  [0207/2V]

## Nets
DISP_BLANK: A_BUS.36
DOM_TENS_SEG_AD: B_BUS.39 Q58.2(G)
DOM_TENS_SEG_B: B_BUS.40 Q59.2(G)
DOM_TENS_SEG_C: C_BUS.1 Q60.2(G)
DOM_TENS_SEG_E: C_BUS.2 Q61.2(G)
DOM_TENS_SEG_F: C_BUS.3 Q62.2(G)
DOM_TENS_SEG_G: C_BUS.4 Q63.2(G)
DOM_UNIT_SEG_A: B_BUS.32 Q64.2(G)
DOM_UNIT_SEG_B: B_BUS.33 Q65.2(G)
DOM_UNIT_SEG_C: B_BUS.34 Q66.2(G)
DOM_UNIT_SEG_D: B_BUS.35 Q67.2(G)
DOM_UNIT_SEG_E: B_BUS.36 Q68.2(G)
DOM_UNIT_SEG_F: B_BUS.37 Q69.2(G)
DOM_UNIT_SEG_G: B_BUS.38 Q70.2(G)
DOW_1_SEG_AB: B_BUS.14 Q40.2(G)
DOW_1_SEG_C: B_BUS.15 Q41.2(G)
DOW_1_SEG_D: B_BUS.16 Q42.2(G)
DOW_1_SEG_EF: B_BUS.17 Q43.2(G)
DOW_1_SEG_GH: B_BUS.18 Q44.2(G)
DOW_1_SEG_K: B_BUS.19 Q45.2(G)
DOW_1_SEG_MS: B_BUS.20 Q46.2(G)
DOW_1_SEG_N: B_BUS.21 Q47.2(G)
DOW_1_SEG_P: B_BUS.22 Q48.2(G)
DOW_1_SEG_RT: B_BUS.23 Q49.2(G)
DOW_1_SEG_U: B_BUS.24 Q50.2(G)
DOW_2_SEG_AB: B_BUS.25 Q51.2(G)
DOW_2_SEG_C: B_BUS.26 Q52.2(G)
DOW_2_SEG_D: B_BUS.27 Q53.2(G)
DOW_2_SEG_EF: B_BUS.28 Q54.2(G)
DOW_2_SEG_GH: B_BUS.29 Q55.2(G)
DOW_2_SEG_PU: B_BUS.30 Q56.2(G)
DOW_2_SEG_R: B_BUS.31 Q57.2(G)
HRS_TENS_SEG_AD: D_BUS.34 Q1.2(G)
HRS_TENS_SEG_B: D_BUS.35 Q2.2(G)
HRS_TENS_SEG_C: D_BUS.36 Q3.2(G)
HRS_TENS_SEG_E: D_BUS.37 Q4.2(G)
HRS_TENS_SEG_F: D_BUS.38 Q5.2(G)
HRS_TENS_SEG_G: D_BUS.39 Q6.2(G)
HRS_UNIT_SEG_A: D_BUS.27 Q7.2(G)
HRS_UNIT_SEG_B: D_BUS.28 Q8.2(G)
HRS_UNIT_SEG_C: D_BUS.29 Q9.2(G)
HRS_UNIT_SEG_D: D_BUS.30 Q10.2(G)
HRS_UNIT_SEG_E: D_BUS.31 Q11.2(G)
HRS_UNIT_SEG_F: D_BUS.32 Q12.2(G)
HRS_UNIT_SEG_G: D_BUS.33 Q13.2(G)
LEAP_YEAR: A_BUS.28 Q71.2(G)
MIN_TENS_SEG_AD: D_BUS.21 Q14.2(G)
MIN_TENS_SEG_B: D_BUS.22 Q15.2(G)
MIN_TENS_SEG_C: D_BUS.23 Q16.2(G)
MIN_TENS_SEG_E: D_BUS.24 Q17.2(G)
MIN_TENS_SEG_F: D_BUS.25 Q18.2(G)
MIN_TENS_SEG_G: D_BUS.26 Q19.2(G)
MIN_UNIT_SEG_A: D_BUS.14 Q20.2(G)
MIN_UNIT_SEG_B: D_BUS.15 Q21.2(G)
MIN_UNIT_SEG_C: D_BUS.16 Q22.2(G)
MIN_UNIT_SEG_D: D_BUS.17 Q23.2(G)
MIN_UNIT_SEG_E: D_BUS.18 Q24.2(G)
MIN_UNIT_SEG_F: D_BUS.19 Q25.2(G)
MIN_UNIT_SEG_G: D_BUS.20 Q26.2(G)
MON_1_SEG_AB: C_BUS.5 Q72.2(G)
MON_1_SEG_C: C_BUS.6 Q73.2(G)
MON_1_SEG_D: C_BUS.7 Q74.2(G)
MON_1_SEG_EF: C_BUS.8 Q75.2(G)
MON_1_SEG_G: C_BUS.9 Q76.2(G)
MON_1_SEG_H: C_BUS.10 Q77.2(G)
MON_1_SEG_K: C_BUS.11 Q78.2(G)
MON_1_SEG_MS: C_BUS.12 Q79.2(G)
MON_1_SEG_N: C_BUS.13 Q80.2(G)
MON_1_SEG_P: C_BUS.14 Q81.2(G)
MON_1_SEG_R: C_BUS.15 Q82.2(G)
MON_1_SEG_U: C_BUS.16 Q83.2(G)
MON_2_SEG_AB: C_BUS.17 Q84.2(G)
MON_2_SEG_C: C_BUS.18 Q85.2(G)
MON_2_SEG_D: C_BUS.19 Q86.2(G)
MON_2_SEG_EF: C_BUS.20 Q87.2(G)
MON_2_SEG_GH: C_BUS.21 Q88.2(G)
MON_2_SEG_PU: C_BUS.22 Q89.2(G)
MON_3_SEG_AB: C_BUS.23 Q90.2(G)
MON_3_SEG_C: C_BUS.24 Q91.2(G)
MON_3_SEG_D: C_BUS.25 Q92.2(G)
MON_3_SEG_EF: C_BUS.26 Q93.2(G)
MON_3_SEG_GH: C_BUS.27 Q94.2(G)
MON_3_SEG_K: C_BUS.28 Q95.2(G)
MON_3_SEG_M: C_BUS.29 Q96.2(G)
MON_3_SEG_N: C_BUS.30 Q97.2(G)
MON_3_SEG_P: C_BUS.31 Q98.2(G)
MON_3_SEG_R: C_BUS.32 Q99.2(G)
MON_3_SEG_S: C_BUS.33 Q100.2(G)
MON_3_SEG_T: C_BUS.34 Q101.2(G)
MON_3_SEG_U: C_BUS.35 Q102.2(G)
N$1: Q1.3(D) R1.1 R2.1
N$2: LED1.P$2(A) R1.2
N$3: LED1.P$9(D) LED1.P$11(D) R2.2
N$4: LED1.P$15(B) R3.2
N$5: Q2.3(D) R3.1
N$6: LED1.P$13(C) R4.2
N$7: Q3.3(D) R4.1
N$8: LED1.P$5(E) LED1.P$7(E) R5.2
N$9: LED1.P$3(F) R6.2
N$10: LED1.P$14(G) R7.2
N$11: Q6.3(D) R7.1
N$12: Q4.3(D) R5.1
N$13: Q5.3(D) R6.1
N$14: Q7.3(D) R8.1
N$15: Q9.3(D) R10.1
N$16: Q11.3(D) R12.1
N$17: Q13.3(D) R14.1
N$18: Q8.3(D) R9.1
N$19: Q10.3(D) R11.1
N$20: Q12.3(D) R13.1
N$21: LED2.P$2(A) R8.2
N$22: LED2.P$15(B) R9.2
N$23: LED2.P$13(C) R10.2
N$24: LED2.P$9(D) LED2.P$11(D) R11.2
N$25: LED2.P$5(E) LED2.P$7(E) R12.2
N$26: LED2.P$3(F) R13.2
N$27: LED2.P$14(G) R14.2
N$28: Q14.3(D) R15.1 R16.1
N$29: Q15.3(D) R17.1
N$30: Q16.3(D) R18.1
N$31: Q19.3(D) R21.1
N$32: Q17.3(D) R19.1
N$33: Q18.3(D) R20.1
N$34: Q20.3(D) R22.1
N$35: Q22.3(D) R24.1
N$36: Q24.3(D) R26.1
N$37: Q26.3(D) R28.1
N$38: Q21.3(D) R23.1
N$39: Q23.3(D) R25.1
N$40: Q25.3(D) R27.1
N$41: LED3.P$2(A) R15.2
N$42: LED3.P$9(D) LED3.P$11(D) R16.2
N$43: LED3.P$15(B) R17.2
N$44: LED3.P$13(C) R18.2
N$45: LED3.P$5(E) LED3.P$7(E) R19.2
N$46: LED3.P$3(F) R20.2
N$47: LED3.P$14(G) R21.2
N$48: LED4.P$2(A) R22.2
N$49: LED4.P$15(B) R23.2
N$50: LED4.P$13(C) R24.2
N$51: LED4.P$9(D) LED4.P$11(D) R25.2
N$52: LED4.P$5(E) LED4.P$7(E) R26.2
N$53: LED4.P$3(F) R27.2
N$54: LED4.P$14(G) R28.2
N$55: Q27.3(D) R29.1 R30.1
N$56: Q28.3(D) R31.1
N$57: Q29.3(D) R32.1
N$58: Q32.3(D) R35.1
N$59: Q30.3(D) R33.1
N$60: Q31.3(D) R34.1
N$61: Q33.3(D) R36.1
N$62: Q35.3(D) R38.1
N$63: Q37.3(D) R40.1
N$64: Q39.3(D) R42.1
N$65: Q34.3(D) R37.1
N$66: Q36.3(D) R39.1
N$67: Q38.3(D) R41.1
N$68: LED5.P$2(A) R29.2
N$69: LED5.P$9(D) LED5.P$11(D) R30.2
N$70: LED5.P$15(B) R31.2
N$71: LED5.P$13(C) R32.2
N$72: LED5.P$5(E) LED5.P$7(E) R33.2
N$73: LED5.P$3(F) R34.2
N$74: LED5.P$14(G) R35.2
N$75: LED6.P$2(A) R36.2
N$76: LED6.P$15(B) R37.2
N$77: LED6.P$13(C) R38.2
N$78: LED6.P$9(D) LED6.P$11(D) R39.2
N$79: LED6.P$5(E) LED6.P$7(E) R40.2
N$80: LED6.P$3(F) R41.2
N$81: LED6.P$14(G) R42.2
N$82: Q40.3(D) R43.1 R44.1
N$83: Q41.3(D) R45.1
N$84: Q42.3(D) R46.1
N$85: Q43.3(D) R47.1 R48.1
N$86: LED7.P$2(A) R44.2
N$87: LED7.P$1(B) R43.2
N$88: LED7.P$15(C) R45.2
N$89: LED7.P$13(D) R46.2
N$90: LED7.P$10(E) R47.2
N$91: LED7.P$11(F) R48.2
N$92: Q44.3(D) R49.1 R50.1
N$93: Q45.3(D) R51.1
N$94: Q46.3(D) R52.1 R53.1
N$95: Q47.3(D) R54.1
N$96: LED7.P$5(G) R50.2
N$97: LED7.P$3(H) R49.2
N$98: LED7.P$4(K) R51.2
N$99: LED7.P$6(M) R52.2
N$100: LED7.P$7(S) R53.2
N$101: LED7.P$18(N) R54.2
N$102: Q48.3(D) R55.1
N$103: Q49.3(D) R56.1 R57.1
N$104: Q50.3(D) R58.1
N$105: LED7.P$16(P) R55.2
N$106: LED7.P$8(T) R56.2
N$107: LED7.P$9(R) R57.2
N$108: LED7.P$14(U) R58.2
N$109: Q58.3(D) R70.1 R71.1
N$110: Q59.3(D) R72.1
N$111: Q60.3(D) R73.1
N$112: Q63.3(D) R76.1
N$113: Q61.3(D) R74.1
N$114: Q62.3(D) R75.1
N$115: Q64.3(D) R77.1
N$116: Q66.3(D) R79.1
N$117: Q68.3(D) R81.1
N$118: Q70.3(D) R83.1
N$119: Q65.3(D) R78.1
N$120: Q67.3(D) R80.1
N$121: Q69.3(D) R82.1
N$122: Q57.3(D) R69.1
N$123: LED8.P$9(R) R69.2
N$124: Q51.3(D) R59.1 R60.1
N$125: Q52.3(D) R61.1
N$126: Q53.3(D) R62.1
N$127: Q54.3(D) R63.1 R64.1
N$128: Q55.3(D) R65.1 R66.1
N$129: Q56.3(D) R67.1 R68.1
N$130: LED8.P$1(B) R59.2
N$131: LED8.P$2(A) R60.2
N$132: LED8.P$15(C) R61.2
N$133: LED8.P$13(D) R62.2
N$134: LED8.P$10(E) R63.2
N$135: LED8.P$11(F) R64.2
N$136: LED8.P$3(H) R65.2
N$137: LED8.P$5(G) R66.2
N$138: LED8.P$14(U) R67.2
N$139: LED8.P$16(P) R68.2
N$140: LED9.P$2(A) R70.2
N$141: LED9.P$9(D) LED9.P$11(D) R71.2
N$142: LED9.P$15(B) R72.2
N$143: LED9.P$13(C) R73.2
N$144: LED9.P$5(E) LED9.P$7(E) R74.2
N$145: LED9.P$3(F) R75.2
N$146: LED9.P$14(G) R76.2
N$147: LED10.P$2(A) R77.2
N$148: LED10.P$15(B) R78.2
N$149: LED10.P$13(C) R79.2
N$150: LED10.P$9(D) LED10.P$11(D) R80.2
N$151: LED10.P$5(E) LED10.P$7(E) R81.2
N$152: LED10.P$3(F) R82.2
N$153: LED10.P$14(G) R83.2
N$155: Q71.3(D) R84.1
N$156: LED10.P$10(DP) R84.2
N$157: Q72.3(D) R85.1 R86.1
N$158: Q73.3(D) R87.1
N$159: Q74.3(D) R88.1
N$160: Q75.3(D) R89.1 R90.1
N$161: LED11.P$2(A) R86.2
N$162: LED11.P$1(B) R85.2
N$163: LED11.P$10(E) R89.2
N$164: LED11.P$11(F) R90.2
N$165: LED11.P$13(D) R88.2
N$166: LED11.P$15(C) R87.2
N$167: Q76.3(D) R91.1
N$168: Q77.3(D) R92.1
N$169: Q78.3(D) R93.1
N$170: Q79.3(D) R94.1 R95.1
N$171: Q84.3(D) R100.1 R101.1
N$172: Q85.3(D) R102.1
N$173: Q86.3(D) R103.1
N$174: Q87.3(D) R104.1 R105.1
N$175: LED12.P$2(A) R101.2
N$176: LED11.P$5(G) R91.2
N$177: LED11.P$3(H) R92.2
N$178: LED11.P$4(K) R93.2
N$179: LED11.P$7(S) R95.2
N$180: LED11.P$6(M) R94.2
N$181: LED12.P$1(B) R100.2
N$182: LED12.P$10(E) R104.2
N$183: LED12.P$11(F) R105.2
N$184: LED12.P$13(D) R103.2
N$185: LED12.P$15(C) R102.2
N$186: Q80.3(D) R96.1
N$187: Q81.3(D) R97.1
N$188: Q82.3(D) R98.1
N$189: Q83.3(D) R99.1
N$190: LED11.P$18(N) R96.2
N$191: LED11.P$16(P) R97.2
N$192: LED11.P$9(R) R98.2
N$193: LED11.P$14(U) R99.2
N$194: Q90.3(D) R110.1 R111.1
N$195: Q88.3(D) R106.1 R107.1
N$196: Q89.3(D) R108.1 R109.1
N$197: LED12.P$5(G) R107.2
N$198: LED12.P$3(H) R106.2
N$199: LED12.P$14(U) R108.2
N$200: LED12.P$16(P) R109.2
N$201: Q91.3(D) R112.1
N$202: Q92.3(D) R113.1
N$203: Q93.3(D) R114.1 R115.1
N$204: LED13.P$2(A) R111.2
N$205: LED13.P$1(B) R110.2
N$206: LED13.P$10(E) R114.2
N$207: LED13.P$11(F) R115.2
N$208: LED13.P$13(D) R113.2
N$209: LED13.P$15(C) R112.2
N$210: Q94.3(D) R116.1 R117.1
N$211: Q95.3(D) R118.1
N$212: Q96.3(D) R119.1
N$213: Q97.3(D) R120.1
N$214: LED13.P$5(G) R117.2
N$215: LED13.P$3(H) R116.2
N$216: LED13.P$4(K) R118.2
N$217: LED13.P$7(S) R123.2
N$218: LED13.P$6(M) R119.2
N$219: Q98.3(D) R121.1
N$220: Q99.3(D) R122.1
N$221: Q100.3(D) R123.1
N$222: Q101.3(D) R124.1
N$223: LED13.P$18(N) R120.2
N$224: LED13.P$16(P) R121.2
N$225: LED13.P$9(R) R122.2
N$226: LED13.P$14(U) R125.2
N$227: Q102.3(D) R125.1
N$229: LED13.P$8(T) R124.2
SEC_TENS_SEG_AD: D_BUS.8 Q27.2(G)
SEC_TENS_SEG_B: D_BUS.9 Q28.2(G)
SEC_TENS_SEG_C: D_BUS.10 Q29.2(G)
SEC_TENS_SEG_E: D_BUS.11 Q30.2(G)
SEC_TENS_SEG_F: D_BUS.12 Q31.2(G)
SEC_TENS_SEG_G: D_BUS.13 Q32.2(G)
SEC_UNIT_SEG_A: D_BUS.1 Q33.2(G)
SEC_UNIT_SEG_B: D_BUS.2 Q34.2(G)
SEC_UNIT_SEG_C: D_BUS.3 Q35.2(G)
SEC_UNIT_SEG_D: D_BUS.4 Q36.2(G)
SEC_UNIT_SEG_E: D_BUS.5 Q37.2(G)
SEC_UNIT_SEG_F: D_BUS.6 Q38.2(G)
SEC_UNIT_SEG_G: D_BUS.7 Q39.2(G)
VDD: A_BUS.38 A_BUS.40 C1.+ LED1.P$4(AN) LED1.P$12(AN) LED1.P$17(AN) LED2.P$4(AN) LED2.P$12(AN) LED2.P$17(AN) LED3.P$4(AN) LED3.P$12(AN) LED3.P$17(AN) LED4.P$4(AN) LED4.P$12(AN) LED4.P$17(AN) LED5.P$4(AN) LED5.P$12(AN) LED5.P$17(AN) LED6.P$4(AN) LED6.P$12(AN) LED6.P$17(AN) LED7.P$12(AN) LED7.P$17(AN) LED8.P$12(AN) LED8.P$17(AN) LED9.P$4(AN) LED9.P$12(AN) LED9.P$17(AN) LED10.P$4(AN) LED10.P$12(AN) LED10.P$17(AN) LED11.P$12(AN) LED11.P$17(AN) LED12.P$12(AN) LED12.P$17(AN) LED13.P$12(AN) LED13.P$17(AN)
VSS: A_BUS.37 A_BUS.39 C1.- Q1.1(S) Q2.1(S) Q3.1(S) Q4.1(S) Q5.1(S) Q6.1(S) Q7.1(S) Q8.1(S) Q9.1(S) Q10.1(S) Q11.1(S) Q12.1(S) Q13.1(S) Q14.1(S) Q15.1(S) Q16.1(S) Q17.1(S) Q18.1(S) Q19.1(S) Q20.1(S) Q21.1(S) Q22.1(S) Q23.1(S) Q24.1(S) Q25.1(S) Q26.1(S) Q27.1(S) Q28.1(S) Q29.1(S) Q30.1(S) Q31.1(S) Q32.1(S) Q33.1(S) Q34.1(S) Q35.1(S) Q36.1(S) Q37.1(S) Q38.1(S) Q39.1(S) Q40.1(S) Q41.1(S) Q42.1(S) Q43.1(S) Q44.1(S) Q45.1(S) Q46.1(S) Q47.1(S) Q48.1(S) Q49.1(S) Q50.1(S) Q51.1(S) Q52.1(S) Q53.1(S) Q54.1(S) Q55.1(S) Q56.1(S) Q57.1(S) Q58.1(S) Q59.1(S) Q60.1(S) Q61.1(S) Q62.1(S) Q63.1(S) Q64.1(S) Q65.1(S) Q66.1(S) Q67.1(S) Q68.1(S) Q69.1(S) Q70.1(S) Q71.1(S) Q72.1(S) Q73.1(S) Q74.1(S) Q75.1(S) Q76.1(S) Q77.1(S) Q78.1(S) Q79.1(S) Q80.1(S) Q81.1(S) Q82.1(S) Q83.1(S) Q84.1(S) Q85.1(S) Q86.1(S) Q87.1(S) Q88.1(S) Q89.1(S) Q90.1(S) Q91.1(S) Q92.1(S) Q93.1(S) Q94.1(S) Q95.1(S) Q96.1(S) Q97.1(S) Q98.1(S) Q99.1(S) Q100.1(S) Q101.1(S) Q102.1(S)
Unconnected: A_BUS.1 A_BUS.2 A_BUS.3 A_BUS.4 A_BUS.5 A_BUS.6 A_BUS.7 A_BUS.8 A_BUS.9 A_BUS.10 A_BUS.11 A_BUS.12 A_BUS.13 A_BUS.14 A_BUS.15 A_BUS.16 A_BUS.17 A_BUS.18 A_BUS.19 A_BUS.20 A_BUS.21 A_BUS.22 A_BUS.23 A_BUS.24 A_BUS.25 A_BUS.26 A_BUS.27 A_BUS.29 A_BUS.30 A_BUS.31 A_BUS.32 A_BUS.33 A_BUS.34 A_BUS.35 B_BUS.1 B_BUS.2 B_BUS.3 B_BUS.4 B_BUS.5 B_BUS.6 B_BUS.7 B_BUS.8 B_BUS.9 B_BUS.10 B_BUS.11 B_BUS.12 B_BUS.13 C_BUS.36 C_BUS.37 C_BUS.38 C_BUS.39 C_BUS.40 D_BUS.40 LED1.P$10(DP) LED2.P$10(DP) LED3.P$10(DP) LED4.P$10(DP) LED5.P$10(DP) LED6.P$10(DP) LED8.P$4(K) LED8.P$6(M) LED8.P$7(S) LED8.P$8(T) LED8.P$18(N) LED9.P$10(DP) LED11.P$8(T) LED12.P$4(K) LED12.P$6(M) LED12.P$7(S) LED12.P$8(T) LED12.P$9(R) LED12.P$18(N)

## Notes on the sheet
- TIME DISPLAY
- ALL 7 SEGMENT DISPLAYS ARE KINGBRIGHT SA08-21CGKWA
- DATE DISPLAY
- ALL 7 SEGMENT DISPLAYS ARE KINGBRIGHT SA08-21CGKWA
  
  ALL 16 SEGMENT DISPLAYS ARE KINGBRIGHT PSA08-12CGKWA
- BUS CONNECTORS

## Library data of the parts
A_BUS B_BUS C_BUS D_BUS = con-lstb:MA20-2: PIN HEADER; OC_FARNELL: unknown; OC_NEWARK: unknown
C1 = rcl:CPOL-EU: POLARIZED CAPACITOR, European symbol
LED1-LED6 LED9 LED10 = NOR gate clock:SA08-21CGKWA
LED7 LED8 LED11-LED13 = NOR gate clock:PSA08-12CGKWA
Q1-Q102 = NOR gate clock:2N7000: N channel MOSFET
R1-R125 = NOR gate clock:R-EU_